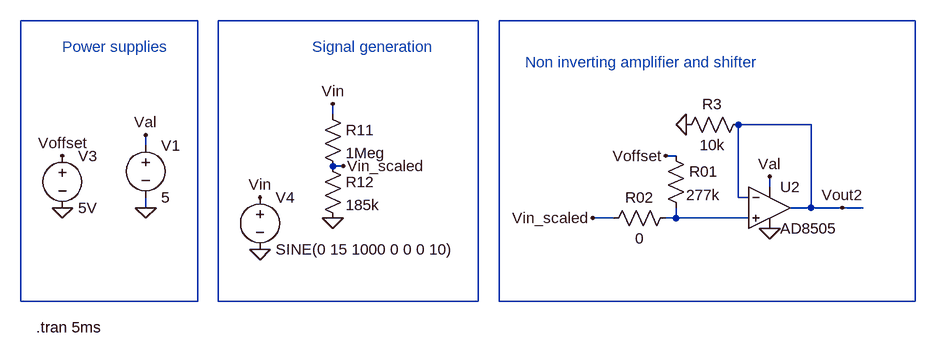
[diagram p0: schematic Two_OpAmps.asc]
Two_OpAmps.asc, the LTspice schematic file:
Version 4
SHEET 1 1940 916
WIRE 208 -80 -64 -80
WIRE 640 -80 240 -80
WIRE 1312 -80 672 -80
WIRE 416 64 416 48
WIRE 1152 80 1040 80
WIRE 128 112 128 96
WIRE 944 128 928 128
WIRE 432 144 416 144
WIRE 1088 176 1088 160
WIRE 1040 192 1040 80
WIRE 1056 192 1040 192
WIRE 128 208 128 192
WIRE 1152 208 1152 80
WIRE 1152 208 1120 208
WIRE 1200 208 1152 208
WIRE 1232 208 1200 208
WIRE 848 224 816 224
WIRE 944 224 944 208
WIRE 944 224 928 224
WIRE 1056 224 944 224
WIRE -64 352 -64 -80
WIRE 208 352 208 -80
WIRE 208 352 -64 352
WIRE 240 352 240 -80
WIRE 640 352 640 -80
WIRE 640 352 240 352
WIRE 672 352 672 -80
WIRE 1312 352 1312 -80
WIRE 1312 352 672 352
FLAG 128 208 0
FLAG 128 96 Val
FLAG 0 128 Voffset
FLAG 304 192 Vin
FLAG 0 208 0
FLAG 304 272 0
FLAG 416 48 Vin
FLAG 416 224 0
FLAG 432 144 Vin_scaled
FLAG 1200 208 Vout2
FLAG 1088 240 0
FLAG 1088 160 Val
FLAG 960 80 0
FLAG 816 224 Vin_scaled
FLAG 928 128 Voffset
SYMBOL voltage 128 96 R0
WINDOW 123 0 0 Left 0
WINDOW 39 0 0 Left 0
SYMATTR InstName V1
SYMATTR Value 5
SYMBOL voltage 0 112 R0
WINDOW 123 0 0 Left 0
WINDOW 39 0 0 Left 0
SYMATTR InstName V3
SYMATTR Value 5V
SYMBOL voltage 304 176 R0
WINDOW 123 0 0 Left 0
WINDOW 39 0 0 Left 0
SYMATTR InstName V4
SYMATTR Value SINE(0 15 1000 0 0 0 10)
SYMBOL res 400 48 R0
SYMATTR InstName R11
SYMATTR Value 1Meg
SYMBOL res 400 128 R0
SYMATTR InstName R12
SYMATTR Value 185k
SYMBOL res 928 112 R0
WINDOW 3 32 76 Left 2
SYMATTR Value 277k
SYMATTR InstName R01
SYMBOL res 944 208 R90
WINDOW 0 0 56 VBottom 2
WINDOW 3 32 56 VTop 2
SYMATTR InstName R02
SYMATTR Value 0
SYMBOL res 1056 64 R90
WINDOW 0 0 56 VBottom 2
WINDOW 3 32 56 VTop 2
SYMATTR InstName R3
SYMATTR Value 10k
SYMBOL Opamps\\AD8505 1088 144 R0
SYMATTR InstName U2
TEXT 384 -40 Left 2 ;Signal generation
TEXT -40 392 Left 2 !.tran 5ms
TEXT 0 -40 Left 2 ;Power supplies
TEXT 712 -16 Left 2 ;Non inverting amplifier and shifter

The netlist it stands for:
* Two_OpAmps.asc
V1 Val 0 5
V3 Voffset 0 5V
V4 Vin 0 SINE(0 15 1000 0 0 0 10)
R11 Vin Vin_scaled 1Meg
R12 Vin_scaled 0 185k
R01 Voffset N004 277k
R02 N004 Vin_scaled 0
R3 Vout2 0 10k
XU2 N004 Vout2 Val 0 Vout2 AD8505  ; pins In+ In- V+ V- OUT
* Signal generation
.tran 5ms
* Power supplies
* Non inverting amplifier and shifter
.backanno
.end